# EAGLE design keypad (EAGLE 7.3.0)
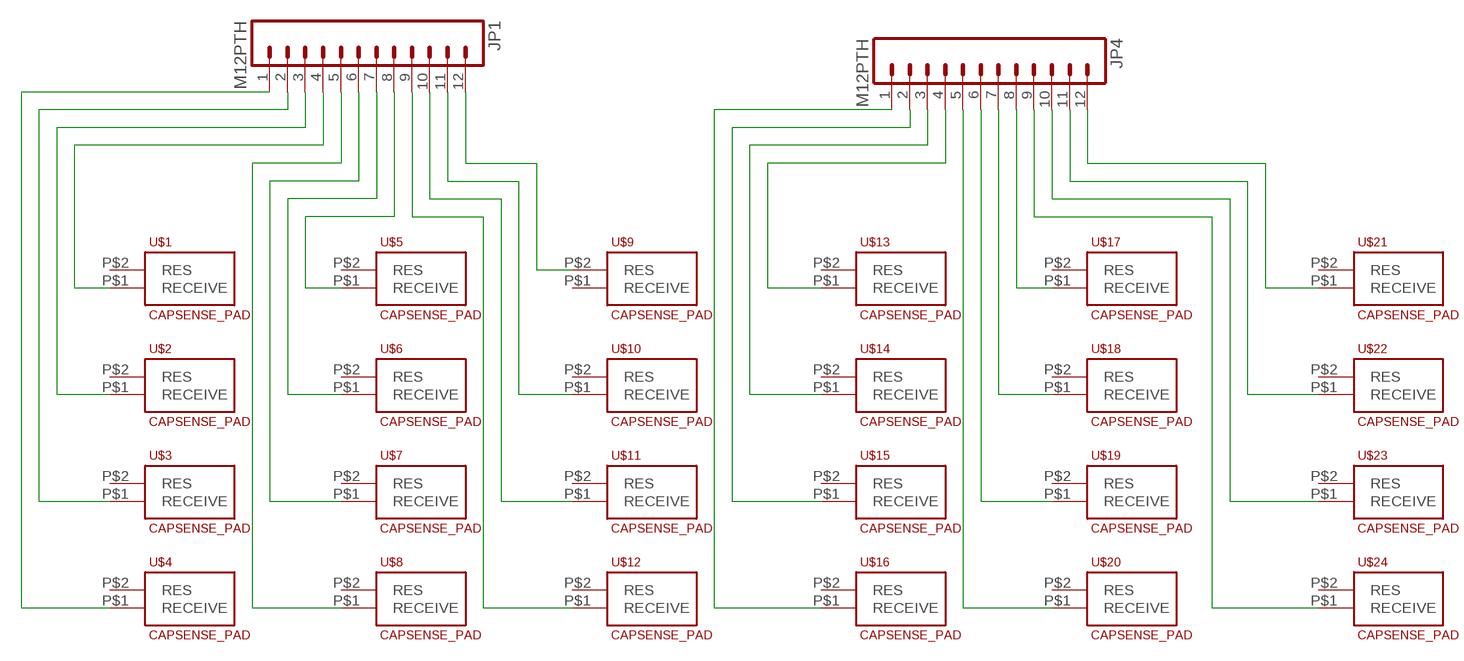
[diagram p0: schematic, sheet 1]

## Parts
JP1  M12PTH  [1X12]
JP4  M12PTH  [1X12]
U$1  CAPSENSE_PAD  [CAPSENSE_PAD]
U$2  CAPSENSE_PAD  [CAPSENSE_PAD]
U$3  CAPSENSE_PAD  [CAPSENSE_PAD]
U$4  CAPSENSE_PAD  [CAPSENSE_PAD]
U$5  CAPSENSE_PAD  [CAPSENSE_PAD]
U$6  CAPSENSE_PAD  [CAPSENSE_PAD]
U$7  CAPSENSE_PAD  [CAPSENSE_PAD]
U$8  CAPSENSE_PAD  [CAPSENSE_PAD]
U$9  CAPSENSE_PAD  [CAPSENSE_PAD]
U$10  CAPSENSE_PAD  [CAPSENSE_PAD]
U$11  CAPSENSE_PAD  [CAPSENSE_PAD]
U$12  CAPSENSE_PAD  [CAPSENSE_PAD]
U$13  CAPSENSE_PAD  [CAPSENSE_PAD]
U$14  CAPSENSE_PAD  [CAPSENSE_PAD]
U$15  CAPSENSE_PAD  [CAPSENSE_PAD]
U$16  CAPSENSE_PAD  [CAPSENSE_PAD]
U$17  CAPSENSE_PAD  [CAPSENSE_PAD]
U$18  CAPSENSE_PAD  [CAPSENSE_PAD]
U$19  CAPSENSE_PAD  [CAPSENSE_PAD]
U$20  CAPSENSE_PAD  [CAPSENSE_PAD]
U$21  CAPSENSE_PAD  [CAPSENSE_PAD]
U$22  CAPSENSE_PAD  [CAPSENSE_PAD]
U$23  CAPSENSE_PAD  [CAPSENSE_PAD]
U$24  CAPSENSE_PAD  [CAPSENSE_PAD]

## Nets
N$1: JP1.1 U$4.P$1(RECEIVE)
N$2: JP1.2 U$3.P$1(RECEIVE)
N$3: JP1.3 U$2.P$1(RECEIVE)
N$4: JP1.4 U$1.P$1(RECEIVE)
N$5: JP1.5 U$8.P$1(RECEIVE)
N$6: JP1.6 U$7.P$1(RECEIVE)
N$7: JP1.7 U$6.P$1(RECEIVE)
N$8: JP1.8 U$5.P$1(RECEIVE)
N$9: JP1.9 U$12.P$1(RECEIVE)
N$10: JP1.10 U$11.P$1(RECEIVE)
N$11: JP1.11 U$10.P$1(RECEIVE)
N$12: JP1.12 U$9.P$2(RES)
N$13: JP4.1 U$16.P$1(RECEIVE)
N$14: JP4.2 U$15.P$1(RECEIVE)
N$15: JP4.3 U$14.P$1(RECEIVE)
N$16: JP4.4 U$13.P$1(RECEIVE)
N$17: JP4.5 U$20.P$1(RECEIVE)
N$18: JP4.6 U$19.P$1(RECEIVE)
N$19: JP4.7 U$18.P$1(RECEIVE)
N$20: JP4.8 U$17.P$1(RECEIVE)
N$21: JP4.9 U$24.P$1(RECEIVE)
N$22: JP4.10 U$23.P$1(RECEIVE)
N$23: JP4.11 U$22.P$1(RECEIVE)
N$24: JP4.12 U$21.P$1(RECEIVE)
Unconnected: U$1.P$2(RES) U$2.P$2(RES) U$3.P$2(RES) U$4.P$2(RES) U$5.P$2(RES) U$6.P$2(RES) U$7.P$2(RES) U$8.P$2(RES) U$9.P$1(RECEIVE) U$10.P$2(RES) U$11.P$2(RES) U$12.P$2(RES) U$13.P$2(RES) U$14.P$2(RES) U$15.P$2(RES) U$16.P$2(RES) U$17.P$2(RES) U$18.P$2(RES) U$19.P$2(RES) U$20.P$2(RES) U$21.P$2(RES) U$22.P$2(RES) U$23.P$2(RES) U$24.P$2(RES)

## Library data of the parts
JP1 JP4 = SparkFun-Connectors:M12: Header 12 Standard 12-pin 0.1" header. Use with straight break away headers (SKU : PRT-00116), right angle break away headers (PRT-00553), swiss pins (PRT-00743), machine pins (PRT-00117), and female headers (PRT-00115).
U$1-U$24 = SparkFun-Electromechanical:CAPSENSE_PAD: Generic copper pad for a capacitive touch sensor.

## Board
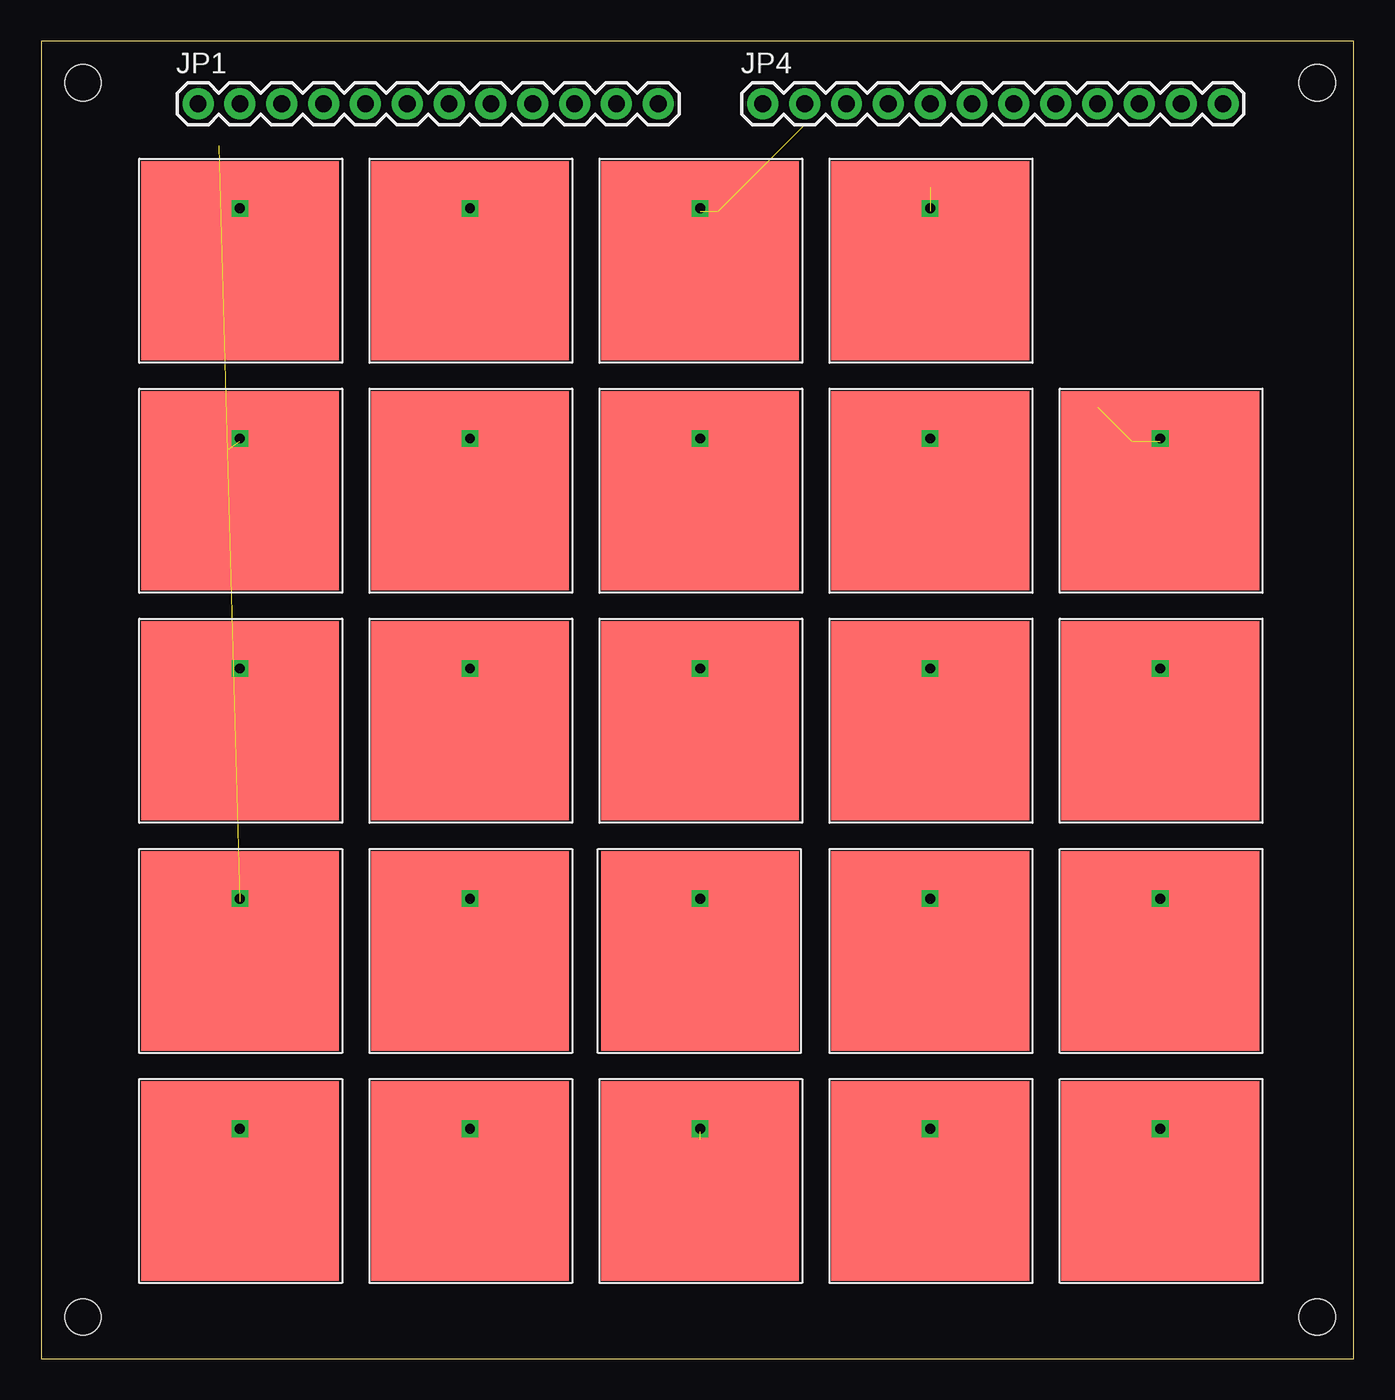
[diagram p1: board, top side]
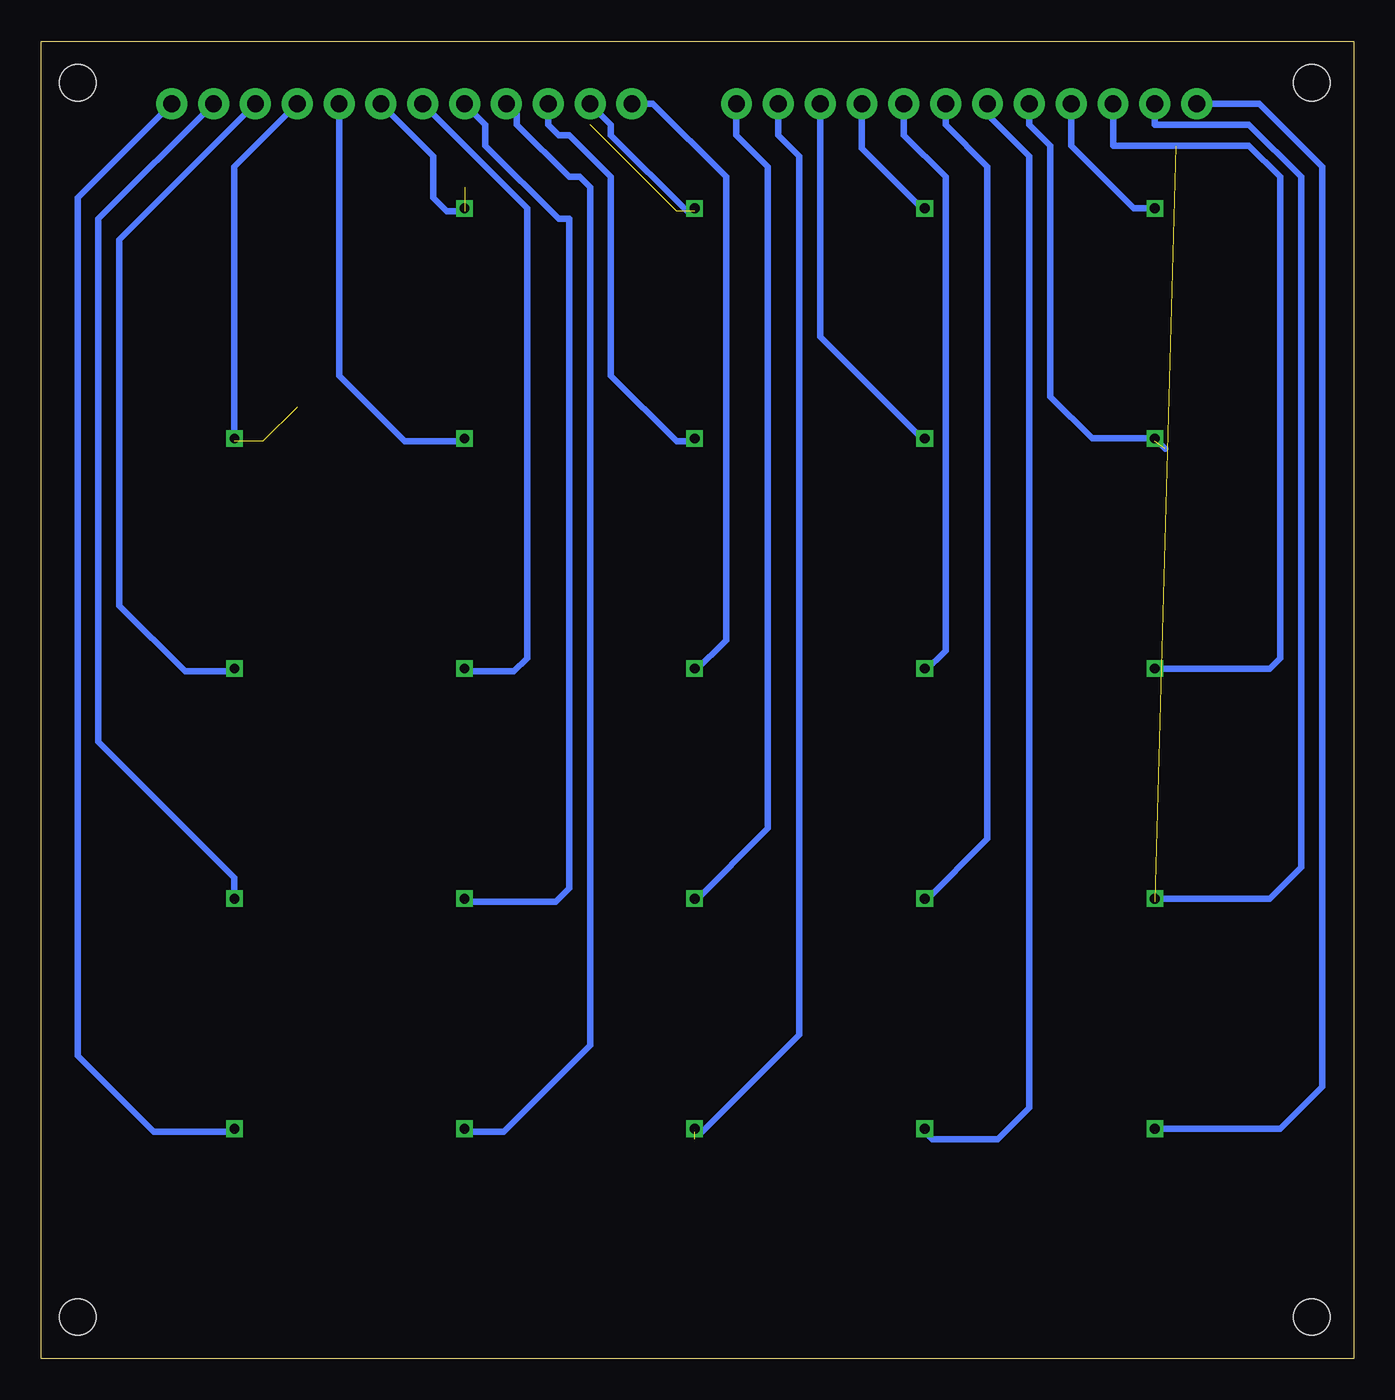
[diagram p2: board, bottom side, seen from below]

Size 79.68 x 80 mm. Coordinates in mm from the lower left corner, seen from the top.
Outline: 0,0 79.68,0 79.68,80 0,80 0,0
Copper layers (1*16): Top 0.035mm / dielectric 1.5mm / Bottom 0.035mm
Design rules "default": minimum track width 10mil, minimum drill 24mil, track to track 8mil, track to pad 8mil, pad to pad 8mil, via to via 8mil, smd to smd 8mil, copper to edge 40mil, drill to drill 8mil, minimum pad ring 10mil, minimum via ring 8mil, stop-mask expansion 4mil, vias tented up to drill 0mil, thermal gap 10mil
Holes 2.2 mm at 2.54,2.54 77.47,2.54 2.54,77.47 77.47,77.47

### Footprints (pad centres in the part's own frame; a part is rotated, then mirrored left to right if it is on the bottom)
1X12 = drill 1.016 pad 1.88: 1 0,0; 2 2.54,0; 3 5.08,0; 4 7.62,0; 5 10.16,0; 6 12.7,0; 7 15.24,0; 8 17.78,0; 9 20.32,0; 10 22.86,0; 11 25.4,0; 12 27.94,0
CAPSENSE_PAD = smd 12 x 6.1: P$1 0,3; P$2 0,-3

### Placement (x,y rotation side)
JP1  9.53,76.2 0 top
JP4  43.81,76.2 0 top
U$1  12.06,66.67 0 top
U$2  12.06,38.73 0 top
U$3  12.06,24.77 0 top
U$4  12.06,10.79 0 top
U$5  26.04,38.73 0 top
U$6  26.04,24.77 0 top
U$7  26.04,10.79 0 top
U$8  12.06,52.7 0 top
U$9  40.01,24.77 180 top
U$10  40.01,10.79 0 top
U$11  26.04,52.7 0 top
U$12  26.04,66.67 0 top
U$13  53.98,10.79 0 top
U$14  40.01,52.7 0 top
U$15  40.01,66.67 0 top
U$16  40.01,38.73 0 top
U$17  53.98,52.7 0 top
U$18  53.98,66.67 0 top
U$19  53.98,38.73 0 top
U$20  53.98,24.77 0 top
U$21  67.94,10.79 0 top
U$22  67.94,24.77 0 top
U$23  67.94,38.73 0 top
U$24  67.94,52.7 0 top

### Tracks (layer width: path | path; a pad name or v marks a point on that pad's centre or on a via)
N$1  (1 unrouted)
  Bottom 0.406: JP1.1 5.71,76.2 1.91,72.39 1.91,16.51 4.45,13.97 11.89,13.97 U$4.P$1
N$2  (2 unrouted)
  Bottom 0.406: JP1.2 12.06,74.93 6.35,74.93 3.17,71.75 3.17,29.84 5.08,27.94 11.89,27.94 U$3.P$1
N$3  (1 unrouted)
  Bottom 0.406: JP1.3 14.61,73.66 6.35,73.66 4.45,71.75 4.45,42.55 5.08,41.91 11.89,41.91 U$2.P$1
N$4  (1 unrouted)
  Bottom 0.406: JP1.4 17.14,73.66 13.34,69.85 12.24,69.85 U$1.P$1
N$5  (1 unrouted)
  Bottom 0.406: JP1.5 19.68,74.93 18.41,73.66 18.41,58.42 15.88,55.88 12.06,55.88 11.43,55.24
N$6  (1 unrouted)
  Bottom 0.406: JP1.6 22.23,75.56 19.68,73.03 19.68,15.24 21.59,13.34 25.57,13.34 U$7.P$1
N$7  (1 unrouted)
  Bottom 0.406: JP1.7 24.77,74.93 22.23,72.39 22.23,31.57 U$6.P$1
N$8  (1 unrouted)
  Bottom 0.406: JP1.8 27.3,74.3 24.77,71.75 24.77,43.01 U$5.P$1
N$9  (1 unrouted)
  Bottom 0.406: JP1.9 29.84,73.48 U$12.P$1
N$10  (1 unrouted)
  Bottom 0.406: JP1.10 32.38,62.05 U$11.P$1
N$11  (2 unrouted)
  Bottom 0.406: JP1.11 34.92,74.3 33.66,73.03 33.66,19.68 39.55,13.79 U$10.P$1
N$12  (1 unrouted)
  Bottom 0.406: JP1.12 37.47,74.3 35.56,72.39 35.56,32.21 U$9.P$2
N$13  (1 unrouted)
  Bottom 0.406: JP4.1 42.55,76.2 38.1,71.75 38.1,43.64 U$16.P$1
N$14  (3 unrouted)
  Bottom 0.406: JP4.2 45.09,74.93 45.09,74.3 40.47,69.67 U$15.P$1
N$15  (1 unrouted)
  Bottom 0.406: JP4.3 48.9,74.93 48.26,74.3 47.62,74.3 45.09,71.75 45.09,59.69 41.1,55.7 U$14.P$1
N$16  (1 unrouted)
  Bottom 0.406: JP4.4 50.8,75.56 50.8,74.93 47.62,71.75 46.99,71.75 46.35,71.12 46.35,19.05 51.61,13.79 U$13.P$1
N$17  (1 unrouted)
  Bottom 0.406: JP4.5 52.7,74.93 52.7,73.66 48.26,69.22 47.62,69.22 47.62,28.57 48.44,27.77 U$20.P$1
N$18  (1 unrouted)
  Bottom 0.406: JP4.6 50.16,69.85 50.16,42.55 50.98,41.73 U$19.P$1
N$19  (2 unrouted)
  Bottom 0.406: JP4.7 55.88,73.03 55.88,70.48 55.07,69.67 U$18.P$1
N$20  (1 unrouted)
  Bottom 0.406: JP4.8 61.59,59.69 57.61,55.7 U$17.P$1
N$21  (3 unrouted)
  Bottom 0.406: JP4.9 67.94,72.39 U$24.P$1
N$22  (1 unrouted)
  Bottom 0.406: JP4.10 74.93,67.94 74.93,45.72 70.94,41.73 U$23.P$1
N$23  (1 unrouted)
  Bottom 0.406: JP4.11 76.2,69.22 76.2,37.47 67.94,29.21 U$22.P$1
N$24  (3 unrouted)
  Bottom 0.406: JP4.12 77.47,70.48 77.47,18.41 72.85,13.79 U$21.P$1
N$25  (via drill 0.6)
  other vias: 12.06,69.85
N$26  (via drill 0.6)
  other vias: 26.04,69.85
N$27  (via drill 0.6)
  other vias: 40.01,69.85
N$28  (via drill 0.6)
  other vias: 53.98,69.85
N$29  (via drill 0.6)
  other vias: 53.98,55.88
N$30  (via drill 0.6)
  other vias: 67.94,55.88
N$31  (via drill 0.6)
  other vias: 40.01,55.88
N$32  (via drill 0.6)
  other vias: 26.04,55.88
N$33  (via drill 0.6)
  other vias: 12.06,55.88
N$34  (via drill 0.6)
  other vias: 12.06,41.91
N$35  (via drill 0.6)
  other vias: 26.04,41.91
N$36  (via drill 0.6)
  other vias: 40.01,41.91
N$37  (via drill 0.6)
  other vias: 53.98,41.91
N$38  (via drill 0.6)
  other vias: 67.94,41.91
N$39  (via drill 0.6)
  other vias: 67.94,27.94
N$40  (via drill 0.6)
  other vias: 53.98,27.94
N$41  (via drill 0.6)
  other vias: 40.01,27.94
N$42  (via drill 0.6)
  other vias: 26.04,27.94
N$43  (via drill 0.6)
  other vias: 12.06,27.94
N$44  (via drill 0.6)
  other vias: 12.06,13.97
N$45  (via drill 0.6)
  other vias: 26.04,13.97
N$46  (via drill 0.6)
  other vias: 40.01,13.97
N$47  (via drill 0.6)
  other vias: 53.98,13.97
N$48  (via drill 0.6)
  other vias: 67.94,13.97